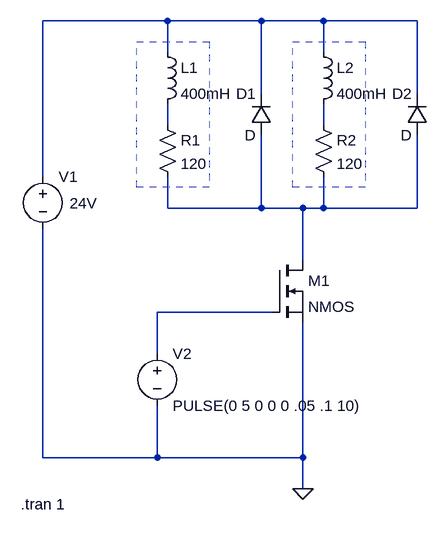
[diagram p0: schematic SolenoidDriver.asc]
SolenoidDriver.asc, the LTspice schematic file:
Version 4
SHEET 1 880 760
WIRE 48 0 -144 0
WIRE 192 0 48 0
WIRE 288 0 192 0
WIRE 432 0 288 0
WIRE 48 48 48 0
WIRE 288 48 288 0
WIRE 192 112 192 0
WIRE 432 112 432 0
WIRE 48 160 48 128
WIRE 288 160 288 128
WIRE -144 240 -144 0
WIRE 48 288 48 240
WIRE 192 288 192 176
WIRE 192 288 48 288
WIRE 256 288 192 288
WIRE 288 288 288 240
WIRE 288 288 256 288
WIRE 432 288 432 176
WIRE 432 288 288 288
WIRE 256 368 256 288
WIRE 208 448 32 448
WIRE 32 512 32 448
WIRE -144 672 -144 320
WIRE 32 672 32 592
WIRE 32 672 -144 672
WIRE 256 672 256 464
WIRE 256 672 32 672
WIRE 256 720 256 672
FLAG 256 720 0
SYMBOL ind 32 32 R0
SYMATTR InstName L1
SYMATTR Value 400mH
SYMBOL ind 272 32 R0
SYMATTR InstName L2
SYMATTR Value 400mH
SYMBOL res 32 144 R0
SYMATTR InstName R1
SYMATTR Value 120
SYMBOL res 272 144 R0
SYMATTR InstName R2
SYMATTR Value 120
SYMBOL diode 208 176 R180
WINDOW 0 24 64 Left 2
WINDOW 3 24 0 Left 2
SYMATTR InstName D1
SYMBOL diode 448 176 R180
WINDOW 0 24 64 Left 2
WINDOW 3 24 0 Left 2
SYMATTR InstName D2
SYMBOL voltage -144 224 R0
WINDOW 3 84 57 Right 2
WINDOW 123 0 0 Left 2
WINDOW 39 0 0 Left 2
SYMATTR InstName V1
SYMATTR Value 24V
SYMBOL nmos 208 368 R0
SYMATTR InstName M1
SYMBOL voltage 32 496 R0
WINDOW 123 0 0 Left 2
WINDOW 39 0 0 Left 2
SYMATTR InstName V2
SYMATTR Value PULSE(0 5 0 0 0 .05 .1 10)
TEXT -178 744 Left 2 !.tran 1
RECTANGLE Normal 112 256 0 32 2
RECTANGLE Normal 352 256 240 32 2

The netlist it stands for:
* SolenoidDriver.asc
L1 N001 N002 400mH
L2 N001 N003 400mH
R1 N002 N004 120
R2 N003 N004 120
D1 N004 N001 D
D2 N004 N001 D
V1 N001 0 24V
M1 N004 N005 0 0 NMOS
V2 N005 0 PULSE(0 5 0 0 0 .05 .1 10)
.model D D
.lib standard.dio
.model NMOS NMOS
.model PMOS PMOS
.lib standard.mos
.tran 1
.backanno
.end